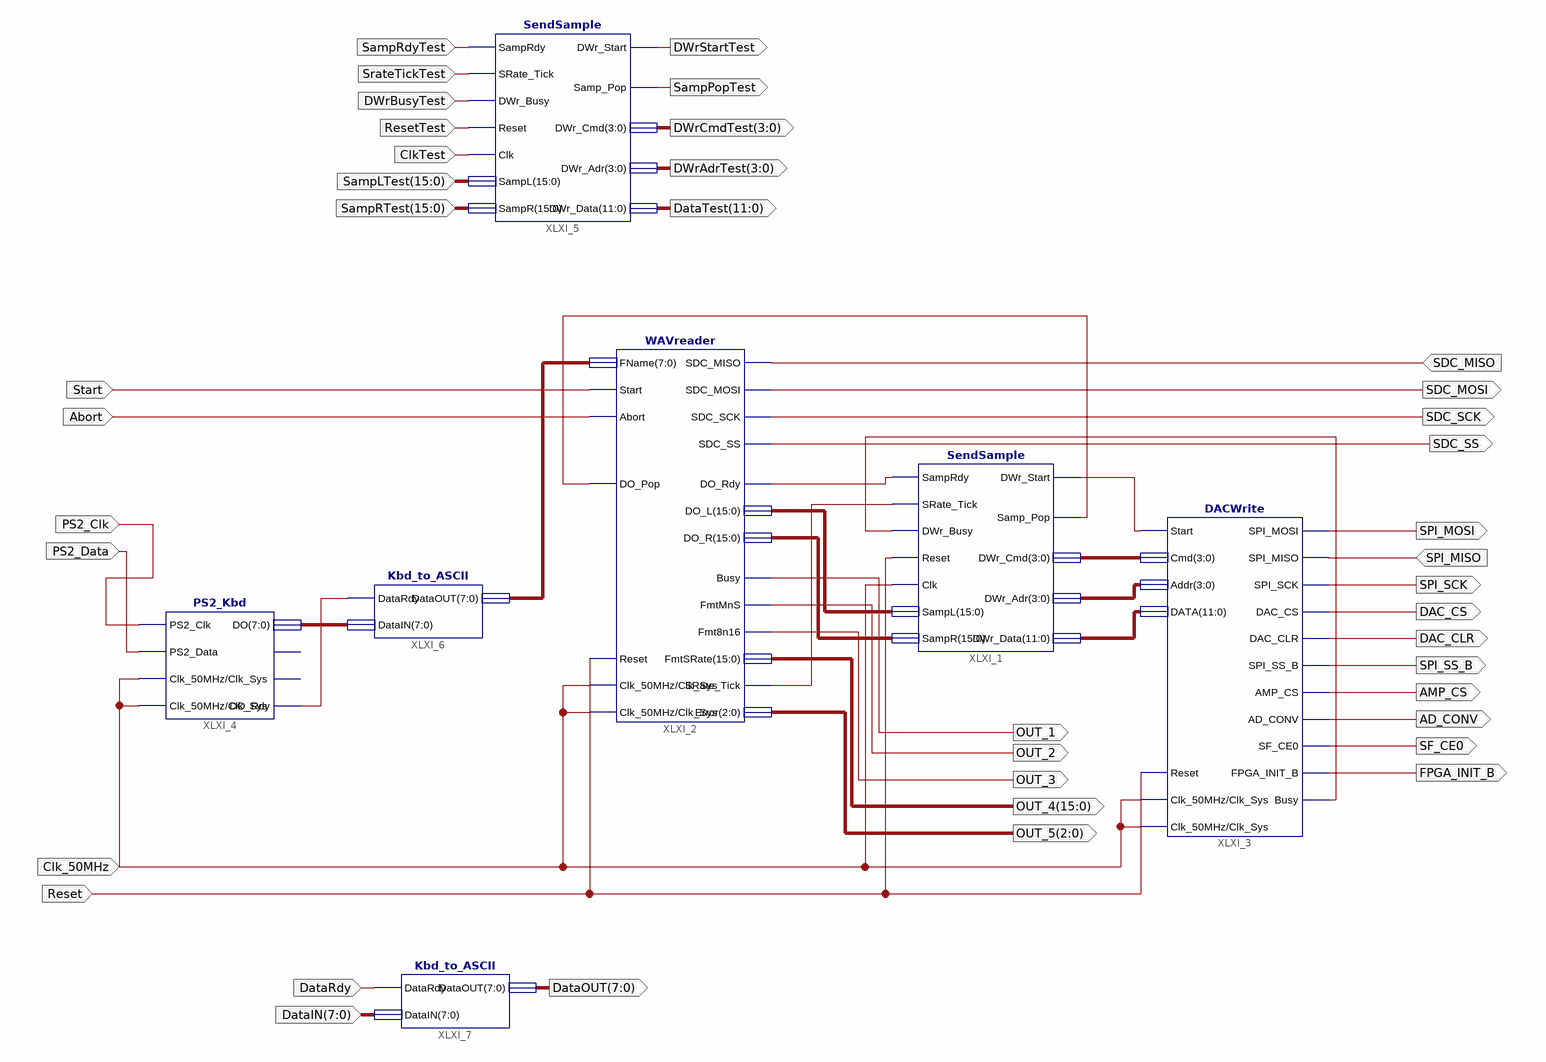
[diagram p0: schematic sheet 1]
// Xilinx ISE schematic main.sch (spartan3e) as structural Verilog: 7 symbols, 40 ports
module main (
  input  Clk_50MHz,
  input  Reset,
  input  SDC_MISO,
  input  Start,
  input  Abort,
  input  SPI_MISO,
  input  SampRdyTest,
  input  SrateTickTest,
  input  DWrBusyTest,
  input  ResetTest,
  input  ClkTest,
  input  [15:0] SampLTest,
  input  [15:0] SampRTest,
  input  PS2_Data,
  input  PS2_Clk,
  input  DataRdy,
  input  [7:0] DataIN,
  output SDC_MOSI,
  output SDC_SCK,
  output SDC_SS,
  output OUT_1,
  output OUT_2,
  output OUT_3,
  output [15:0] OUT_4,
  output [2:0] OUT_5,
  output DAC_CLR,
  output DAC_CS,
  output SPI_MOSI,
  output SPI_SCK,
  output SPI_SS_B,
  output AMP_CS,
  output AD_CONV,
  output FPGA_INIT_B,
  output SF_CE0,
  output DWrStartTest,
  output SampPopTest,
  output [3:0] DWrCmdTest,
  output [3:0] DWrAdrTest,
  output [11:0] DataTest,
  output [7:0] DataOUT
);

  wire XLXN_13, XLXN_14, XLXN_17, XLXN_22, XLXN_30, XLXN_50;
  wire [3:0] XLXN_31, XLXN_32;
  wire [7:0] XLXN_34, XLXN_49;
  wire [11:0] XLXN_33;
  wire [15:0] XLXN_23, XLXN_24;

  SendSample XLXI_1 (
    .SampRdy(XLXN_22), .SRate_Tick(XLXN_13), .DWr_Busy(XLXN_14), .Reset(Reset), .Clk(Clk_50MHz),
    .SampL(XLXN_23), .SampR(XLXN_24), .DWr_Start(XLXN_30), .Samp_Pop(XLXN_17), .DWr_Cmd(XLXN_31),
    .DWr_Adr(XLXN_32), .DWr_Data(XLXN_33));
  WAVreader XLXI_2 (
    .FName(XLXN_34), .Start(Start), .Abort(Abort), .SDC_MOSI(SDC_MOSI), .SDC_SCK(SDC_SCK), .SDC_SS(SDC_SS),
    .SDC_MISO(SDC_MISO), .DO_Rdy(XLXN_22), .DO_L(XLXN_23), .DO_R(XLXN_24), .DO_Pop(XLXN_17), .Busy(OUT_1),
    .FmtMnS(OUT_2), .Fmt8n16(OUT_3), .FmtSRate(OUT_4), .SRate_Tick(XLXN_13), .Error(OUT_5), .Reset(Reset),
    .Clk_50MHz(Clk_50MHz), .Clk_Sys(Clk_50MHz));
  DACWrite XLXI_3 (
    .Reset(Reset), .Start(XLXN_30), .SPI_MISO(SPI_MISO), .Cmd(XLXN_31), .Addr(XLXN_32), .DATA(XLXN_33),
    .DAC_CLR(DAC_CLR), .DAC_CS(DAC_CS), .SPI_MOSI(SPI_MOSI), .SPI_SCK(SPI_SCK), .SPI_SS_B(SPI_SS_B),
    .AMP_CS(AMP_CS), .AD_CONV(AD_CONV), .SF_CE0(SF_CE0), .FPGA_INIT_B(FPGA_INIT_B), .Busy(XLXN_14),
    .Clk_50MHz(Clk_50MHz), .Clk_Sys(Clk_50MHz));
  PS2_Kbd XLXI_4 (
    .PS2_Clk(PS2_Clk), .PS2_Data(PS2_Data), .Clk_50MHz(Clk_50MHz), .DO_Rdy(XLXN_50), .DO(XLXN_49),
    .Clk_Sys(Clk_50MHz));  // open: E0, F0
  SendSample XLXI_5 (
    .SampRdy(SampRdyTest), .SRate_Tick(SrateTickTest), .DWr_Busy(DWrBusyTest), .Reset(ResetTest),
    .Clk(ClkTest), .SampL(SampLTest), .SampR(SampRTest), .DWr_Start(DWrStartTest), .Samp_Pop(SampPopTest),
    .DWr_Cmd(DWrCmdTest), .DWr_Adr(DWrAdrTest), .DWr_Data(DataTest));
  Kbd_to_ASCII XLXI_6 (.DataRdy(XLXN_50), .DataIN(XLXN_49), .DataOUT(XLXN_34));
  Kbd_to_ASCII XLXI_7 (.DataRdy(DataRdy), .DataIN(DataIN), .DataOUT(DataOUT));
endmodule
